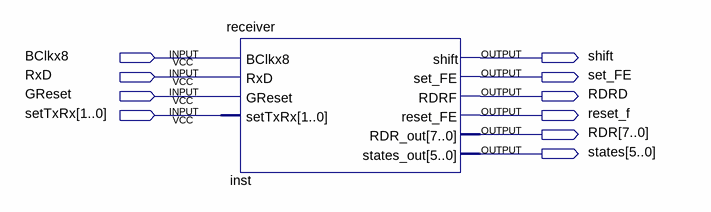
[diagram p0: schematic sheet]
// Quartus schematic testing_counter.bdf as structural Verilog: 1 symbols, 10 pins
module testing_counter (
  input  BClkx8,
  input  RxD,
  input  GReset,
  input  [1:0] setTxRx,
  output shift,
  output set_FE,
  output RDRD,
  output reset_f,
  output [7:0] RDR,
  output [5:0] states
);

  receiver inst (
    .BClkx8(BClkx8), .RxD(RxD), .GReset(GReset), .setTxRx(setTxRx), .shift(shift), .set_FE(set_FE),
    .RDRF(RDRD), .reset_FE(reset_f), .RDR_out(RDR), .states_out(states));
endmodule
